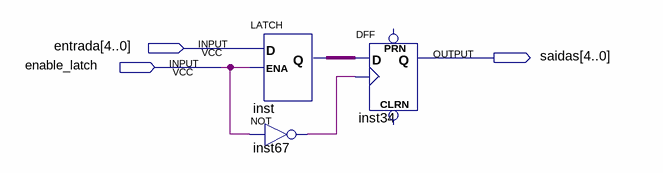
[diagram p0: schematic sheet]
// Quartus schematic Barramento_5x.bdf as structural Verilog: 3 symbols, 3 pins
module Barramento_5x (
  input  [4:0] entrada,
  input  enable_latch,
  output [4:0] saidas
);

  wire inst67_out, inst_q;

  LATCH inst[4:0] (.D(entrada), .ENA(enable_latch), .Q(inst_q));
  not inst67 (inst67_out, enable_latch);
  DFF inst34[4:0] (.CLK(inst67_out), .D(inst_q), .Q(saidas));  // open: CLRN, PRN
endmodule
